# Altium schematic sheet Radio.SchDoc: Radio
size A3; DrawnBy: Hank Wu, Connor Kwon; Address1: ECE Department; Address2: University of Canterbury; Address3: Christchurch 8041; Address4: New Zealand; Revision: 1
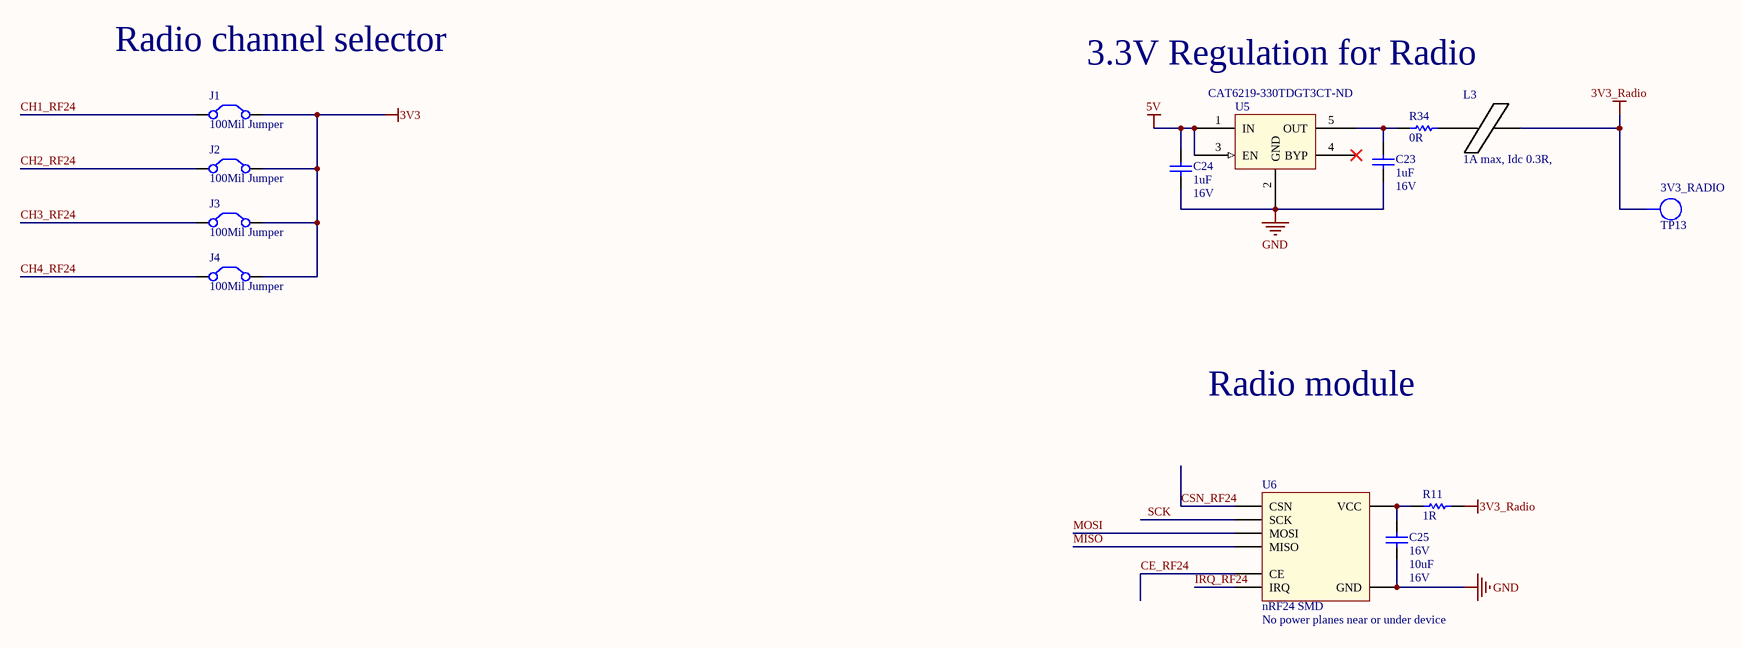
[diagram p0: Radio.SchDoc]

## Parts
C23  Max Voltage: 16V  [CAPC1608L]  (hidden comment: 1uF)
C24  Max Voltage: 16V  [CAPC1608L]  (hidden comment: 1uF)
C25  Voltage - Rated: 16V  [CAPC2012L]  (hidden comment: 10uF)
J1  100Mil Jumper  [JMP2.54]
J2  100Mil Jumper  [JMP2.54]
J3  100Mil Jumper  [JMP2.54]
J4  100Mil Jumper  [JMP2.54]
L3  1A max, Idc 0.3R,  [INDC3216L]
R11  1R  [RESC3216L]
R34  0R  [RESC1608L]
TP13  3V3_RADIO  [TP_1206]  (no BOM)
U5  Supplier Part Number: CAT6219-330TDGT3CT-ND  [SOT95P280X145-5N]  (hidden comment: CAT6219-330TDGT3)
U6  nRF24 SMD  Warning: No power planes near or under device  [NRF24]

## Nets
3V3: J1.2(C2) J2.2(C2) J3.2(C2) J4.2(C2)
3V3_Radio: L3.2 R11.2 TP13.1
5V: C24.2 U5.1(IN) U5.3(EN)
GND: C23.1 C24.1 C25.1 U5.2(GND) U6.2(GND)
CE_RF24: U6.3(CE)
CH1_RF24: J1.1(C1)
CH2_RF24: J2.1(C1)
CH3_RF24: J3.1(C1)
CH4_RF24: J4.1(C1)
CSN_RF24: U6.4(CSN)
IRQ_RF24: U6.8(IRQ)
MISO: U6.7(MISO)
MOSI: U6.6(MOSI)
SCK: U6.5(SCK)
NetC23_2: C23.2 R34.1 U5.5(OUT)
NetC25_2: C25.2 R11.1 U6.1(VCC)
NetL3_1: L3.1 R34.2

Not connected (* = marked no-connect by the designer): U5 4(BYP)*

## Notes on the sheet
- Radio channel selector
- 3.3V Regulation for Radio
- Radio module
- Title
- Drawn by:
- Date:
- Time:
- Revision:
- Sheet
- of
- File:

## Library data of the parts
C23 C24 = CC_1uF_0603: CAP CER 1uF Y5V -20% +80% 16V 0603; PackageReference: 0603; Code_IPC: 1608 [0603]; Verify: *; Supplier: ECE Dept; Storage Location: PCB Assembly WS; Value: 1uF
C25 = CC_10uF_16V_0805: CAP CER 10uF X5R 16V 0805; Manufacturer: Samsung Electro-Mechanics; Manufacturer Part Number: CL21A106KOQNNWE; Note: Footprint corresponds to dimensions for bulk cassette packaging. This case size has tightened tolerances.; Tolerance: ±10%; Notification: Current market demand for these product types have resulted in fluctuating and extending lead times. Lead times may differ.; PackageReference: 0805; Code_IPC: 2012[0805]; Supplier 1: Digi-Key; RoHS: RoHS Compliant; Category: Capacitors; Stock 1: 20000; Pricing 1: 1=0.35, 10=0.25, 100=0.1178, 500=0.08254, 1000=0.06831 (NZD); Packaging: Cut Tape (CT); Part Status: Active; Temperature Coefficient: X5R; Operating Temperature: -55°C ~ 85°C; Features: -; Ratings: -; Applications: General Purpose; Mounting Type: Surface Mount, MLCC; Package / Case: 0805 (2012 Metric); Size / Dimension: 0.079" L x 0.049" W (2.00mm x 1.25mm); Height - Seated (Max): -; Thickness (Max): 0.055" (1.40mm); Lead Spacing: -; Lead Style: -; ComponentLink1URL: http://www.samsungsem.com/kr/support/product-search/mlcc/CL21A106KOQNNWE.jsp; ComponentLink1Description: http://www.samsungsem.com/kr/support/product-search/mlcc/CL21A106KOQNNWE.jsp; Supplier Part Number 1: 1276-2894-1-ND; Value: 10uF; Max Voltage: 16V
J1-J4 = TP_JUMPER: 2.54mm Jumper Thru Hole; Pitch Spacing: 2.54; No. of Rows: 1; No. of Positions: 2; Supplier: ECE Dept; Supplier 1: Farnell; Supplier Part Number 1: 1097975; Storage Location: ECE$ Store
L3 = IN_Ferrite-Bead: Ferrite Bead, Rdc 0.3R, Z100MHZ 600R, Imax 1A, SMD 1206; Manufacturer: FAIR-RITE; Manufacturer PN: 2512066017Y1; DC Current Rating: 1; DC Resistance Max: 0.08; Ferrite Case Style: 1206 ^3216 Metric]; Frequency Range: 50MHz to 1; Impedance: 600; Impedance Tolerance: ± 25%; Supplier: ECE Dept; Storage Location: PCB Assembly WS; Ferrite Mounting: SMD; Supplier 1: Farnell; Supplier Part Number 1: 1612060; Manufacturer Part Number: 2512066017Y1; Value: 1A max, Idc 0.3R,
R11 = RT_1R: RES 1R OHM 1/4W 5% 1206 SMD; Storage Location: PCB Assembly WS; Supplier: ECE Dept; Value: 1R
R34 = RS_0R0: RES 0.0 OHM 1/10W 5% 0603 SMD; Storage Location: PCB Assembly WS; Supplier: ECE Dept; Value: 0R
TP13 = TP_1206: Test-Point 3.3x1.6x2.1mm SMD; Manufacturer: Harwin Inc; Manufacturer Part Number: S1751-46R; Value: TP; Manufacturer PN: *; Storage Location: ProtoPlace; Mounting Type: Surface Mount; Type: PC Test Point; Supplier 1: Digi-Key; Supplier Part Number 1: 952-1478-2-ND; Supplier 2: Farnell; Supplier Part Number 2: 1826282; Supplier: ECE Dept
U5 = SV_CAT6219-330TDGT3: IC REG LIN 3.3V 500MA TSOT23-5; Voltage - Input (Max): 5.5V; Voltage Dropout (Max): 0.5V @ 500mA; Manufacturer Part Number: CAT6219-330TDGT3; Base Part Number: CAT6219; Current - Output: 500mA; Package / Case: SOT-23-5 Thin, TSOT-23-5; Supplier: Digi-Key; Supplier Device Package: TSOT-23-5; Voltage - Output (Min/Fixed): 3.3V; ComponentLink1URL: http://www.onsemi.com/pub/Collateral/CAT6219-D.PDF; ComponentLink1Description: http://www.onsemi.com/pub/Collateral/CAT6219-D.PDF; Supplier 1: Digi-Key
U6 = NRF24: nRF24 SMD Module